# Altium schematic sheet NRF24L01.SchDoc
size A3; SheetNumber: 3; SheetTotal: 11
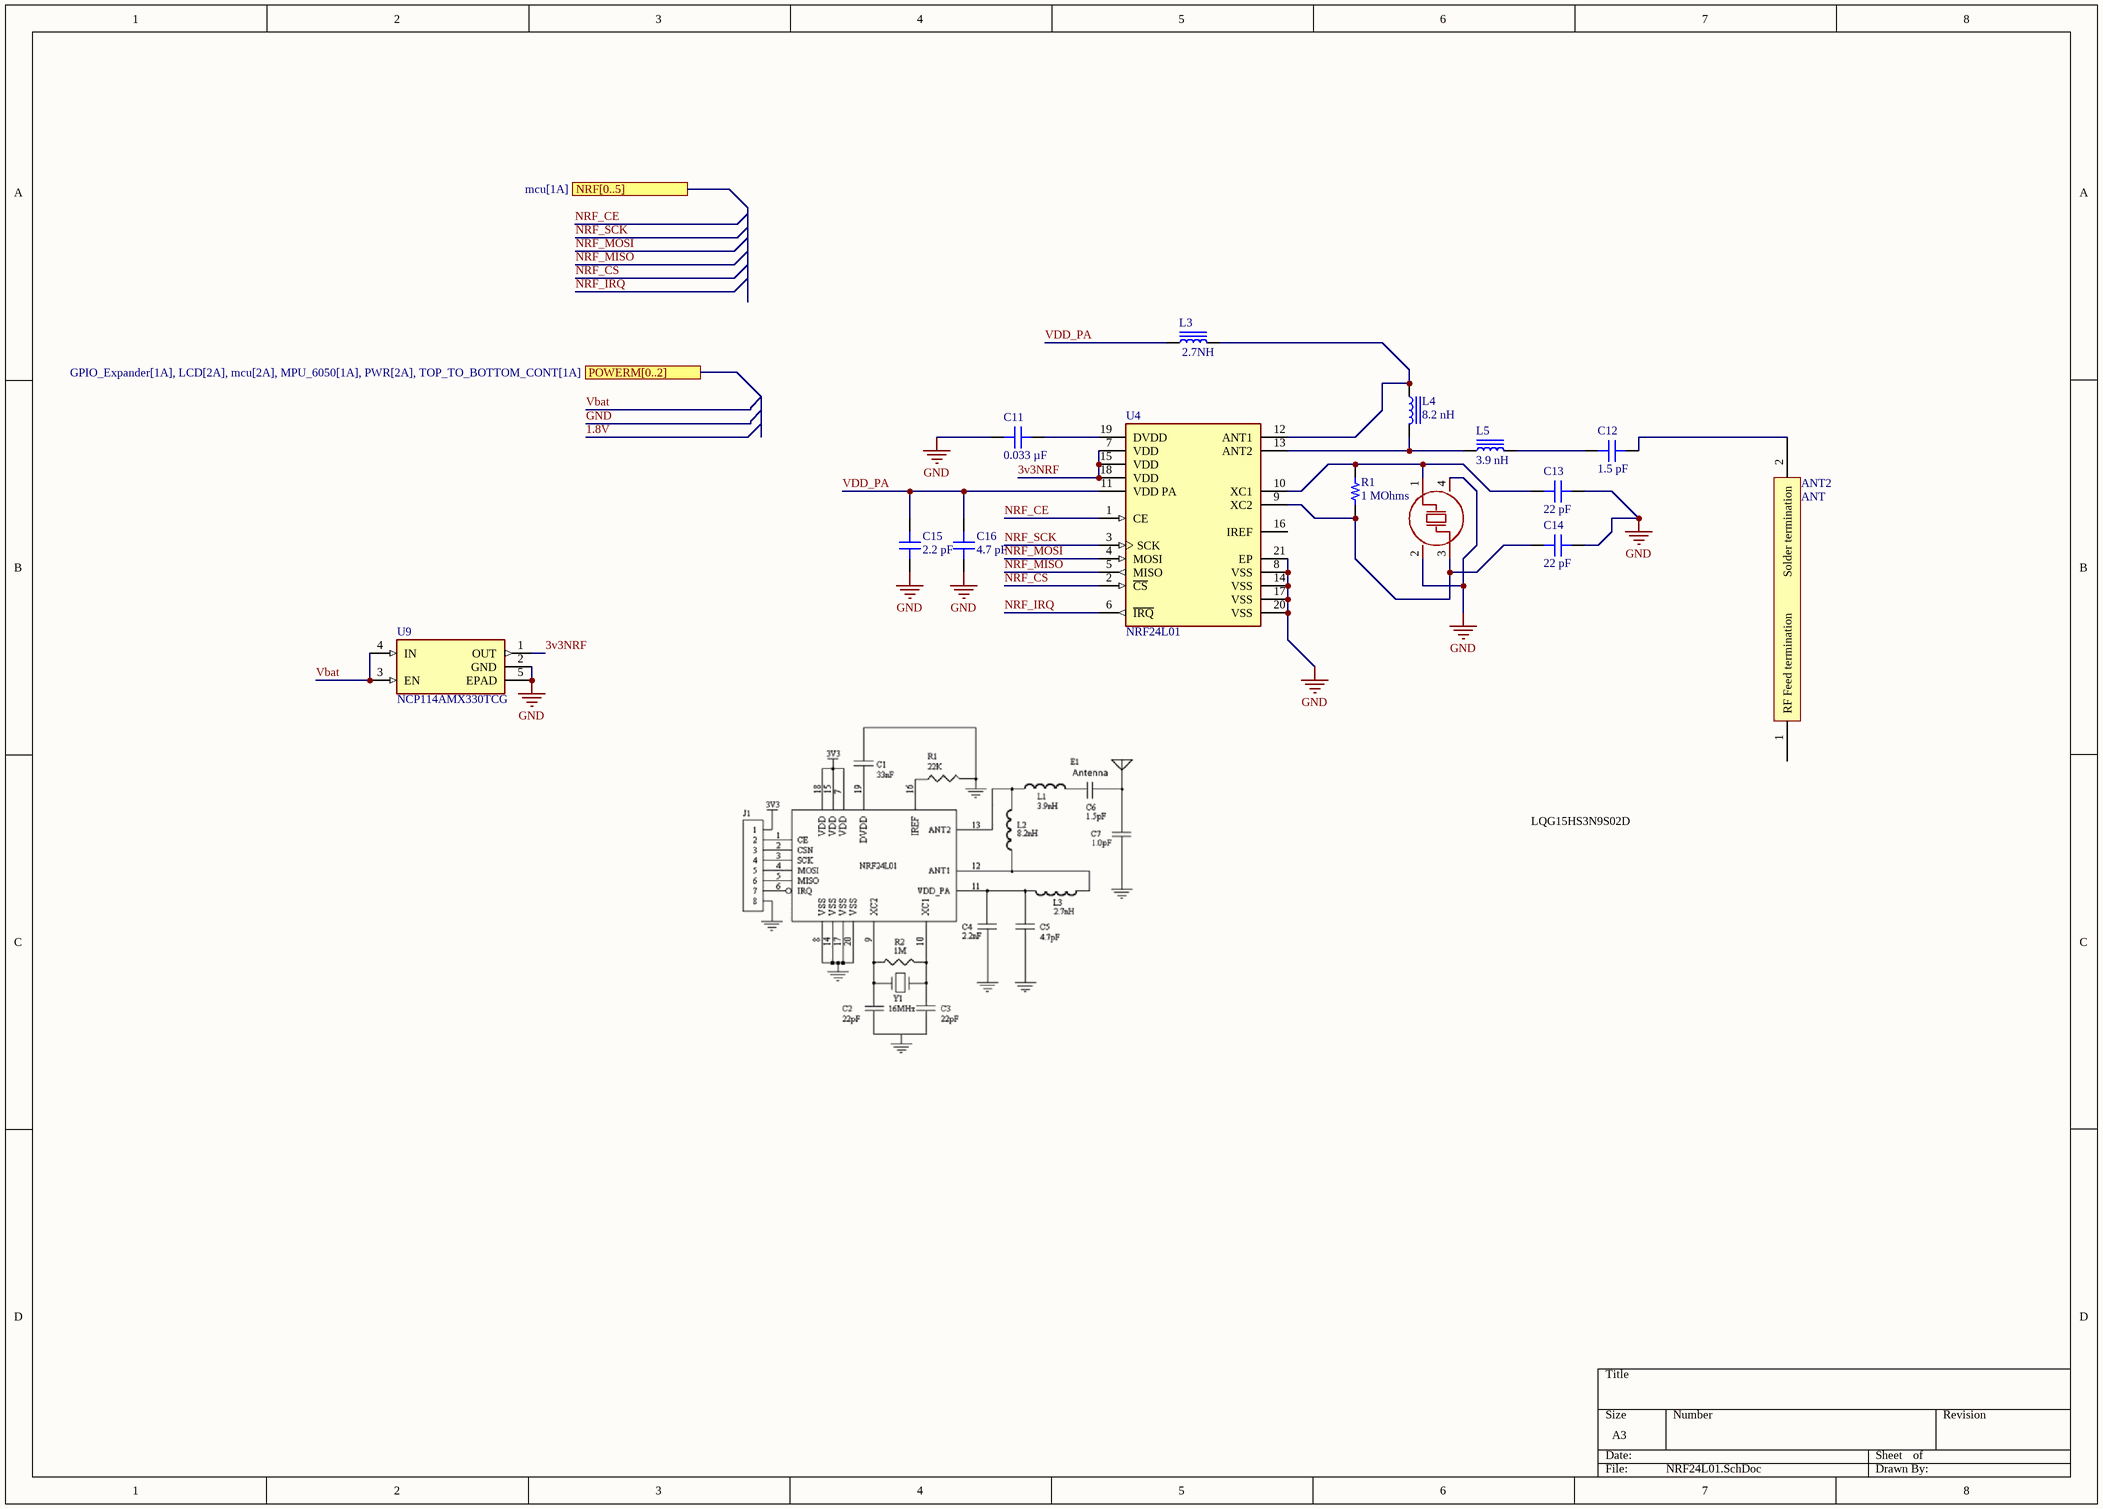
[diagram p0: NRF24L01.SchDoc]

## Parts
ANT2  ANT  [CAPC3216X13N]
C11  Capacitance: 0.033 µF  [CAP 0402_1005]
C12  Capacitance: 1.5 pF  [CAP 0402_1005]
C13  Capacitance: 22 pF  [CAP 0402_1005]
C14  Capacitance: 22 pF  [CAP 0402_1005]
C15  Capacitance: 2.2 pF  [CAP 0402_1005]
C16  Capacitance: 4.7 pF  [CAP 0402_1005]
L3  2.7NH  [IND 0402_1005 RF WW]
L4  8.2 nH  [Murata LQW15 0402]
L5  3.9 nH  [Murata LQW15 0402]
R1  1 MOhms  [RES 0402_1005]
U4  NRF24L01  [FP-NRF24L01-IPC_C]
U9  NCP114AMX330TCG  [REG_NCP114AMX330TCG]
X2  16MHz  [CRYSTAL-SMD_4P-L3.2-W2.5-BL]  (value not drawn)

## Ports
NRF[0..5] (see mcu[1A]), POWERM[0..2] (see GPIO_Expander[1A], LCD[2A], mcu[2A], MPU_6050[1A], PWR[2A], TOP_TO_BOTTOM_CONT[1A])

## Nets
GND: C11.1 C13.2 C14.2 C15.1 C16.1 U4.8(VSS) U4.14(VSS) U4.17(VSS) U4.20(VSS) U4.21(EP) U9.2(GND) U9.5(EPAD) X2.2 X2.4
3v3NRF: U4.7(VDD) U4.15(VDD) U4.18(VDD) U9.1(OUT)
NRF_CE: U4.1(CE)
NRF_CS: U4.2(~{CS})
NRF_IRQ: U4.6(~{IRQ})
NRF_MISO: U4.5(MISO)
NRF_MOSI: U4.4(MOSI)
NRF_SCK: U4.3(SCK)
Vbat: U9.3(EN) U9.4(IN)
VDD_PA: C15.2 C16.2 L3.1 U4.11(VDD_PA)
NetANT2_2: ANT2.2(Solder_termination) C12.2
NetC11_2: C11.2 U4.19(DVDD)
NetC12_1: C12.1 L5.2
NetC13_1: C13.1 R1.2 U4.10(XC1) X2.1(OSC1)
NetC14_1: C14.1 R1.1 U4.9(XC2) X2.3(OSC2)
NetL3_2: L3.2 L4.1 U4.12(ANT1)
NetL4_2: L4.2 L5.1 U4.13(ANT2)

Not connected (* = marked no-connect by the designer): ANT2 1(RF_Feed_termination); U4 16(IREF)

## Notes on the sheet
- LQG15HS3N9S02D

## Library data of the parts
ANT2 = ANT: MFR.Part #: 2450AT18D0100E; Manufacturer: Johanson Dielectrics; JLCPCB Part #: C2917718
C11 = 0402B333K100CT: CAP CER 0.033UF 10V X7R 0402; MFR.Part #: 0402B333K160NT; Manufacturer: FH (Guangdong Fenghua Advanced Tech); JLCPCB Part #: C60425
C12 = 251R07S1R5AV4T: CAP CER 1.5PF 250V C0G/NP0 0402; MFR.Part #: 0402CG1R5C500NT; Manufacturer: FH (Guangdong Fenghua Advanced Tech); JLCPCB Part #: C1552
C13 C14 = 201R07S220GV4T: CAP CER 22PF 200V C0G/NP0 0402; MFR.Part #: 0402CG220J500NT; Manufacturer: FH (Guangdong Fenghua Advanced Tech); Voltage - Rated: 200V; JLCPCB Part #: C1555
C15 = 251R07S2R2AV4T: CAP CER 2.2PF 250V C0G/NP0 0402; MFR.Part #: C1559; Manufacturer: FH (Guangdong Fenghua Advanced Tech); JLCPCB Part #: 0402CG2R2C500NT
C16 = 201R07S4R7AV4T: CAP CER 4.7PF 200V C0G/NP0 0402; MFR.Part #: 0402CG4R7C500NT; Manufacturer: FH (Guangdong Fenghua Advanced Tech); JLCPCB Part #: C1569
L3 = 744765027A: FIXED IND 2.7NH 640MA 120MOHM SM; MFR.Part #: CS0402-2N7B-S; Manufacturer: Chilisin Elec; ComponentLink1Description: Datasheet; ComponentLink1URL: https://katalog.we-online.de/pbs/datasheet/744765027A.pdf; ComponentLink2Description: DigiKey Link; ComponentLink2URL: https://www.digikey.com/en/products/detail/würth-elektronik/744765027A/1994078; JLCPCB Part #: C142182; Value: 2.7NH
L4 = LQW15AN8N2J8ZD: FIXED IND 8.2NH 1.5A 0.069OHM SM; MFR.Part #: LQW15AN8N2G80D; Manufacturer: Murata Electronics; ComponentLink1Description: Datasheet; ComponentLink1URL: https://search.murata.co.jp/Ceramy/image/img/P02/JELF243A-9138.pdf; ComponentLink2Description: DigiKey Link; ComponentLink2URL: https://www.digikey.com/en/products/detail/murata-electronics/LQW15AN8N2J8ZD/6799017; Value: 8.2 nH; JLCPCB Part #: C307610
L5 = LQW15AN3N9D10D: FIXED IND 3.9NH 900MA 0.04OHM SM; MFR.Part #: LQG15HS3N9S02D; Manufacturer: Murata Electronics; ComponentLink1Description: Datasheet; ComponentLink1URL: https://search.murata.co.jp/Ceramy/image/img/P02/JELF243A-0051.pdf; ComponentLink2Description: DigiKey Link; ComponentLink2URL: https://www.digikey.com/en/products/detail/murata-electronics/LQW15AN3N9D10D/2594912; Value: 3.9 nH; JLCPCB Part #: C77109
R1 = MCS04020C1004FE000: RES SMD 1M OHM 1% 1/10W 0402; Manufacturer: UNI-ROYAL(Uniroyal Elec); MFR.Part #: 0402WGF1004TCE; Value: 1 MOhms; ComponentLink1Description: Datasheet; ComponentLink1URL: http://www.vishay.com/docs/28705/mcx0x0xpro.pdf; ComponentLink2Description: DigiKey Link; ComponentLink2URL: http://digikey.com/product-detail/en/vishay-beyschlag/MCS04020C1004FE000/MCS0402-1.00M-CFCT-ND/2607931; JLCPCB Part #: C26083
U4 = CMP-228436-000003-1: IC RF TXRX ISM>1GHZ 20VFQFN; MFR.Part #: NRF24L01P-R; Manufacturer: Nordic Semicon; JLCPCB Part #: C8791
U9 = NCP114AMX330TCG: Linear Voltage Regulator IC Positive Fixed 1 Output 300mA 4-UDFN (1.0x1.0); Manufacturer: onsemi; JLCPCB Part #: C133056; MFR.Part #: NCP114AMX330TCG
X2 = ABM8G-16.000MHZ-18-D2Y-T: Manufacturer: Abracon LLC; MFR.Part #: ABM8G-16.000MHZ-18-D2Y-T; JLCPCB Part #: C1985423